# Altium schematic sheet BMS_V5.SchDoc
size A3; SheetNumber: 1; SheetTotal: 1
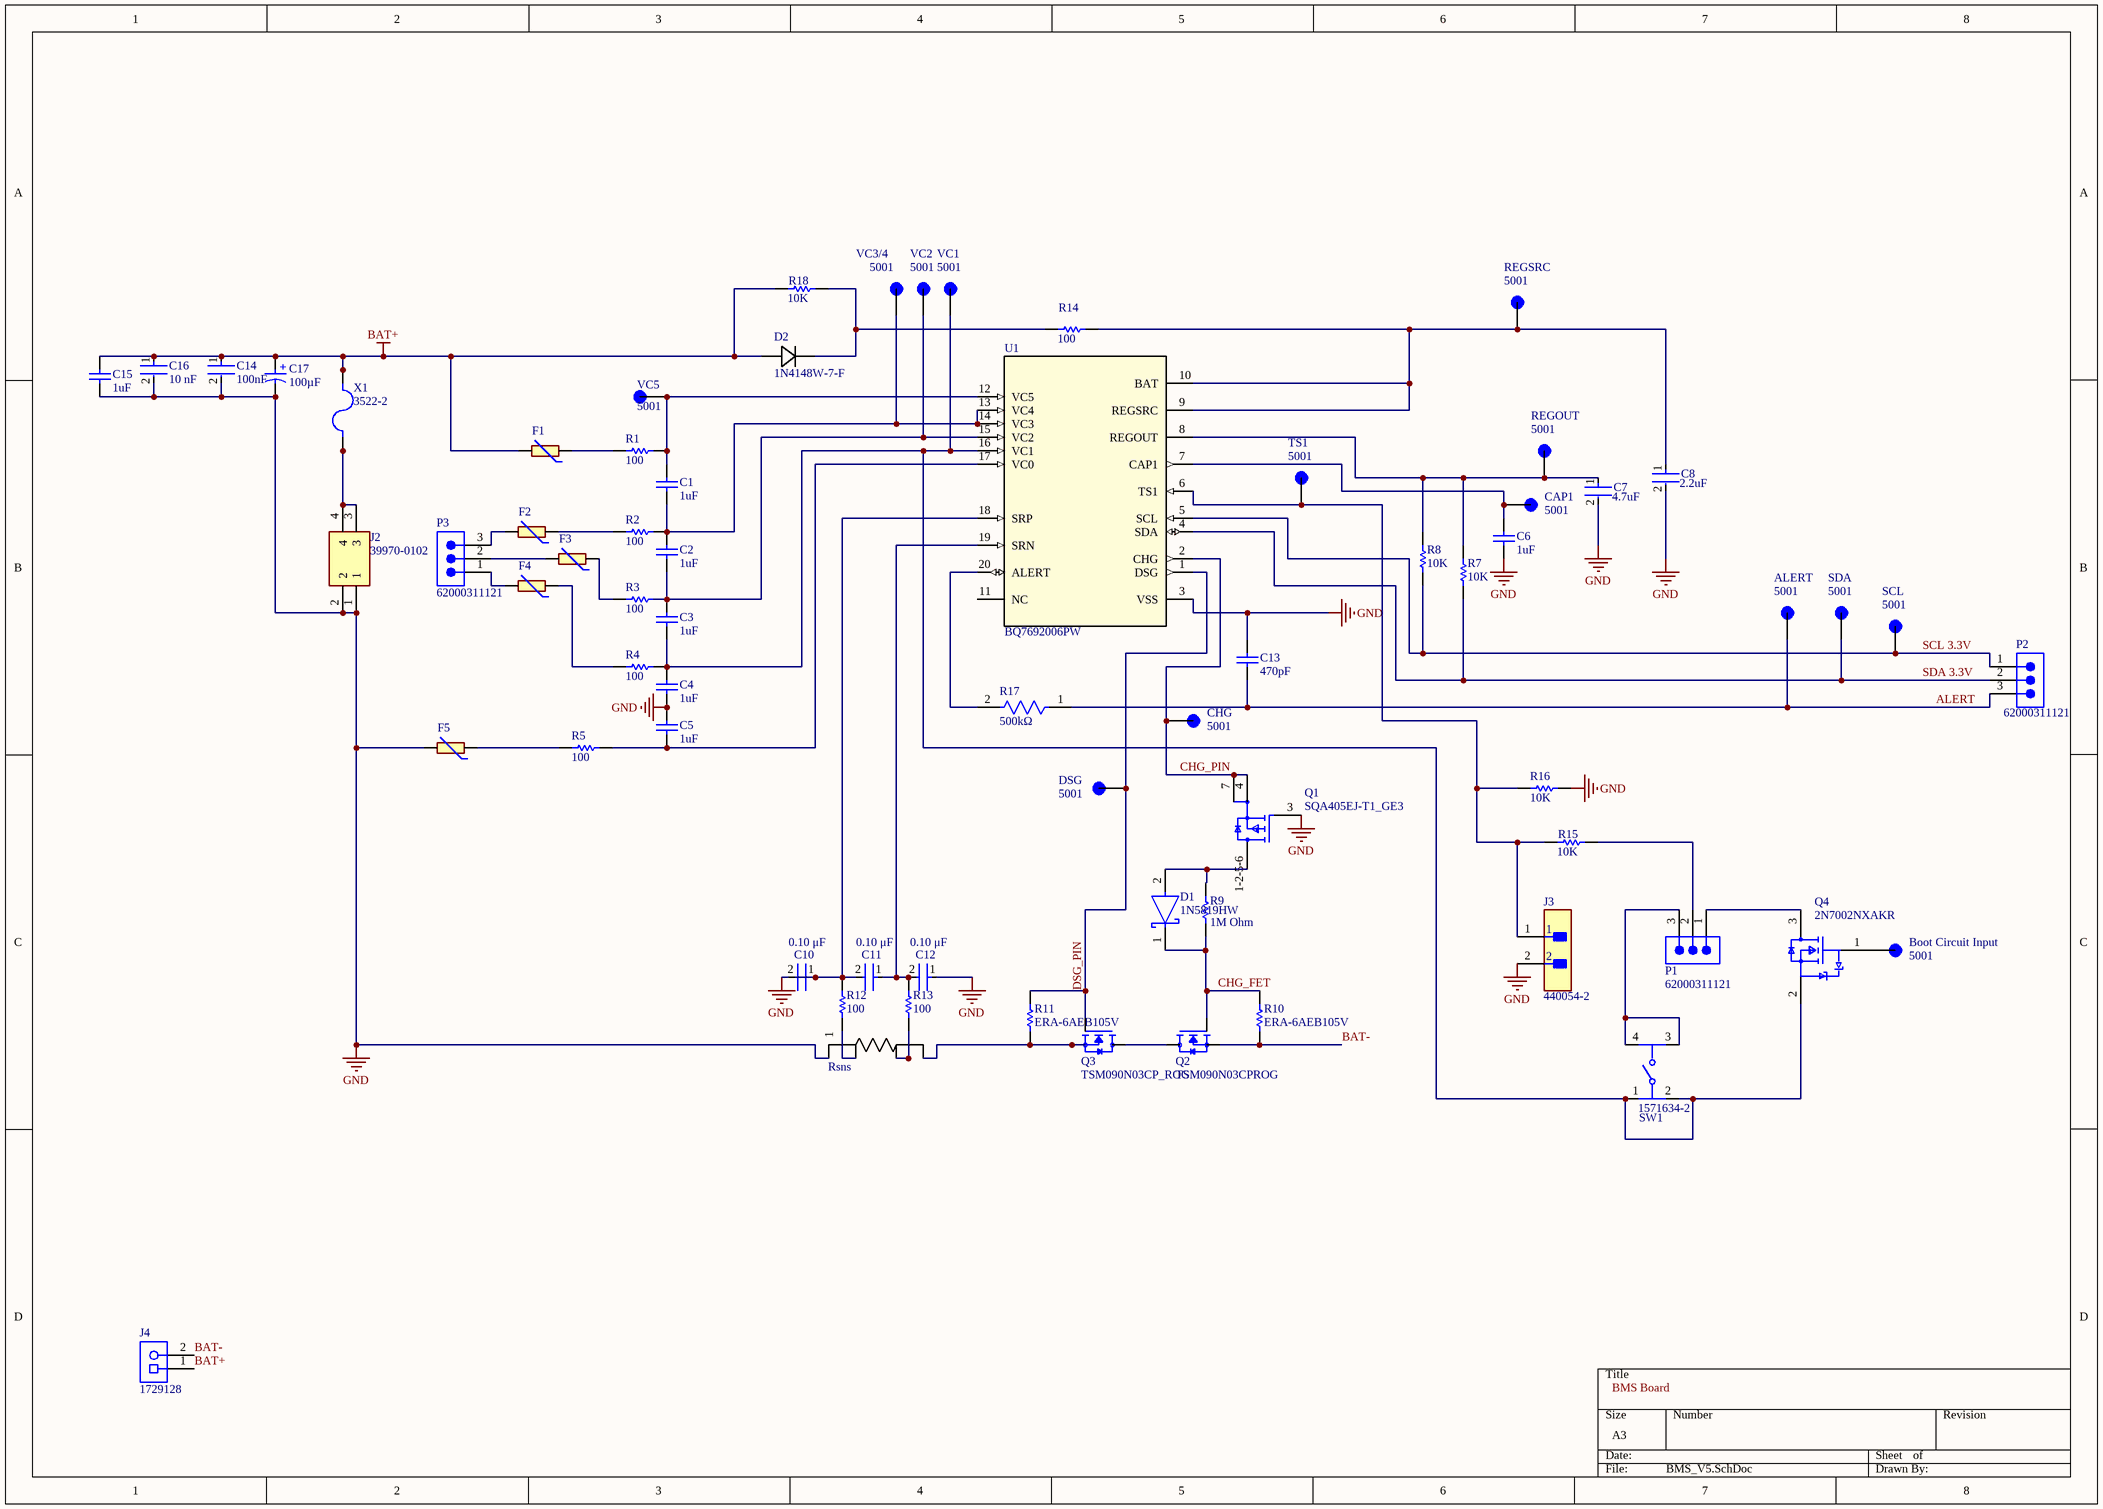
[diagram p0: BMS_V5.SchDoc]

## Parts
ALERT  5001  [KEYSTONE_5001]
Boot_Circuit_Input  5001  [KEYSTONE_5001]
C1  1uF  [CAPC2013X140X50LL20T25]
C2  1uF  [CAPC2013X140X50LL20T25]
C3  1uF  [CAPC2013X140X50LL20T25]
C4  1uF  [CAPC2013X140X50LL20T25]
C5  1uF  [CAPC2013X140X50LL20T25]
C6  1uF  [CAPC2013X140X50LL20T25]
C7  Capacitance: 4.7uF  [FP-GRM21B-0_15-IPC_B]  (hidden comment: GRM21BR61H475KE51L)
C8  Capacitance: 2.2uF  [FP-1206-L_3_2_0_15-W_1_6-IPC_C]  (hidden comment: TMK316B7225KLHT)
C10  Capacitance: 0.10 μF  [FP-C1206C-EB-MFG]  (hidden comment: C1206C104M4JACAUTO)
C11  Capacitance: 0.10 μF  [FP-C1206C-EB-MFG]  (hidden comment: C1206C104M4JACAUTO)
C12  Capacitance: 0.10 μF  [FP-C1206C-EB-MFG]  (hidden comment: C1206C104M4JACAUTO)
C13  470pF  [CAPC2013X145X48NL20T23]
C14  Capacitance: 100nF  [FP-1206-L_3_2_0_2-W_1_6_0-MFG]  (hidden comment: 12061C104KAZ2A)
C15  1uF  [CAPC2013X140X50LL20T25]
C16  value 10 nF  [FP-CC0603-DA-MFG]  (hidden comment: CC0603KRX7R9BB103)
C17  Capacitance: 100µF  [WCAP-ASLI_D6.3H7.7]  (hidden comment: 865080545012)
CAP1  5001  [KEYSTONE_5001]
CHG  5001  [KEYSTONE_5001]
D1  1N5819HW  [FP-SOD123-IPC_A]
D2  1N4148W-7-F  [SOD123_DIO]
DSG  5001  [KEYSTONE_5001]
F1  0ZCJ0005FF2E  [FUSC3216X85N]  (value not drawn)
F2  0ZCJ0005FF2E  [FUSC3216X85N]  (value not drawn)
F3  0ZCJ0005FF2E  [FUSC3216X85N]  (value not drawn)
F4  0ZCJ0005FF2E  [FUSC3216X85N]  (value not drawn)
F5  0ZCJ0005FF2E  [FUSC3216X85N]  (value not drawn)
J2  39970-0102  [399700102]
J3  440054-2  [FP-440054-2-MFG]
J4  1729128  [PHOE-1729128-2_V]
P1  62000311121  [62000311121]
P2  62000311121  [62000311121]
P3  62000311121  [62000311121]
Q1  SQA405EJ-T1_GE3  [FP-SQA405EJ-T1_GE3-MFG]
Q2  TSM090N03CPROG  [TRANS_TSM090N03CPROG]
Q3  TSM090N03CP_ROG  [TRANS_TSM090N03CP_ROG]
Q4  2N7002NXAKR  [FP-SOT23-IPC_B]
R1  100  [RESC2013X60X30ML20T20]
R2  100  [RESC2013X60X30ML20T20]
R3  100  [RESC2013X60X30ML20T20]
R4  100  [RESC2013X60X30ML20T20]
R5  100  [RESC2013X60X30ML20T20]
R7  10K  [RESC2013X60X35NL10T20]
R8  10K  [RESC2013X60X35NL10T20]
R9  1M Ohm  [RESC2013X60X40LL20T25]
R10  ERA-6AEB105V  [RESC2013X60X40LL20T25]
R11  ERA-6AEB105V  [RESC2013X60X40LL20T25]
R12  100  [RESC2013X50X30LL20T20]
R13  100  [RESC2013X50X30LL20T20]
R14  100  [RESC2013X60X30ML20T20]
R15  10K  [RESC2013X60X35NL10T20]
R16  10K  [RESC2013X60X35NL10T20]
R17  Resistance: 500kΩ  [FP-CRMA1206-IPC_A]
R18  10K  [RESC2013X60X35NL10T20]
REGOUT  5001  [KEYSTONE_5001]
REGSRC  5001  [KEYSTONE_5001]
Rsns  WSL36375L000FEA  [WSL3637_VIS]  (value not drawn)
SCL  5001  [KEYSTONE_5001]
SDA  5001  [KEYSTONE_5001]
SW1  1571634-2  [FP-1571634-2-MFG]
TS1  5001  [KEYSTONE_5001]
U1  BQ7692006PW  [PW0020A_N]
VC1  5001  [KEYSTONE_5001]
VC2  5001  [KEYSTONE_5001]
VC3/4  5001  [KEYSTONE_5001]
VC5  5001  [KEYSTONE_5001]
X1  3522-2  [FUSE_3522-2]

## Nets
BAT+: C14.1 C15.2 C16.1 C17.1(P) D2.2 F1.2 J4.1 R18.1 X1.2A X1.2B
GND: C4.1 C5.2 C6.1 C7.2 C8.2 C10.2 C12.1 C13.2 C14.2 C15.1 C16.2 C17.2(N) F5.2 J2.1 J2.2 J3.2 Q1.3(G) R16.2 Rsns.1 U1.3(VSS)
ALERT: ALERT.TP C13.1 P2.3 R17.1
BAT-: J4.2 Q2.3(S) R10.1
CHG_FET: D1.1(C) Q2.1(G) R9.1 R10.2
CHG_PIN: CHG.TP Q1.4(S) Q1.7(S) U1.2(CHG)
DSG_PIN: DSG.TP Q3.1(G) R11.2 U1.1(DSG)
SCL 3.3V: P2.1 R8.1 SCL.TP U1.5(SCL)
SDA 3.3V: P2.2 R7.1 SDA.TP U1.4(SDA)
NetBoot_Circuit_Input_TP: Boot_Circuit_Input.TP Q4.1(G)
NetC1_1: C1.1 C2.2 R2.2 U1.13(VC4) U1.14(VC3) VC3/4.TP
NetC1_2: C1.2 R1.2 U1.12(VC5) VC5.TP
NetC2_1: C2.1 C3.2 R3.2 U1.15(VC2) VC2.TP
NetC3_1: C3.1 C4.2 Q4.2(S) R4.2 SW1.1 SW1.2 U1.16(VC1) VC1.TP
NetC5_1: C5.1 R5.2 U1.17(VC0)
NetC6_2: C6.2 CAP1.TP U1.7(CAP1)
NetC7_1: C7.1 R7.2 R8.2 REGOUT.TP U1.8(REGOUT)
NetC8_1: C8.1 R14.1 REGSRC.TP U1.9(REGSRC) U1.10(BAT)
NetC10_1: C10.1 C11.2 R12.2 U1.18(SRP)
NetC11_1: C11.1 C12.2 R13.2 U1.19(SRN)
NetD1_2: D1.2(A) Q1.1-2-5-6(D) R9.2
NetD2_1: D2.1 R14.2 R18.2
NetF1_1: F1.1 R1.1
NetF2_1: F2.1 R2.1
NetF2_2: F2.2 P3.3
NetF3_1: F3.1 R3.1
NetF3_2: F3.2 P3.2
NetF4_1: F4.1 R4.1
NetF4_2: F4.2 P3.1
NetF5_1: F5.1 R5.1
NetJ2_3: J2.3 J2.4 X1.1A X1.1B
NetJ3_1: J3.1 R15.1 R16.1 TS1.TP U1.6(TS1)
NetP1_1: P1.1 Q4.3(D)
NetP1_2: P1.2 R15.2
NetP1_3: P1.3 SW1.3 SW1.4
NetQ2_2: Q2.2(D) Q3.2(D)
NetQ3_3: Q3.3(S) R11.1 Rsns.4
NetR12_1: R12.1 Rsns.2
NetR13_1: R13.1 Rsns.3
NetR17_2: R17.2 U1.20(ALERT)

Not connected (* = marked no-connect by the designer): U1 11(NC)

## Notes on the sheet
- BMS Board
- (in symbol CMP-03913-54202496-1) +

## Library data of the parts
ALERT Boot_Circuit_Input CAP1 CHG DSG REGOUT REGSRC SCL SDA TS1 VC1 VC2 VC3/4 VC5 = 5001: MF: Keystone Electronics; Package: None; Price: None; Value: *; MP: 5001; Availability: Unavailable
C1-C6 C15 = CMP-2007-03234-1: Part Number: C0805C105K3RACTU; Manufacturer: Kemet
C7 = CMP-06035-059131-1: Chip Multilayer Ceramic Capacitors for General Purpose, 0805, 4.7uF, X5R, 15%, 10%, 50V; Case Code (Metric): 2012; Height: 1.25mm; Width: 0.049inch; Packaging: Tape and Reel; Mount: Surface Mount; Case/Package: 0805; REACH SVHC: No SVHC; Case Code (Imperial): 0805; Dielectric: X5R; Thickness: 0.055inch; Voltage Rating: 50V; Material: Ceramic; Depth: 1.25mm; Min Operating Temperature: -55°C; Lead Free: Lead Free; Max Operating Temperature: 85°C; Tolerance: 10%; Length: 2mm; Voltage Rating (DC): 50V
C8 = CMP-14477-002871-2: None; Voltage Rating: 25V; Tolerance: 10%; Dielectric: X7R; Min Operating Temperature: -55°C; Max Operating Temperature: 125°C; Height: 1.6mm; RoHS Compliant: Yes; Voltage Rating (DC): 25V; Case Code (Metric): 3216; Package Quantity: 2000; Packaging: Tape and Reel; Width: 0.063inch; Termination: SMD/SMT; Case/Package: 1206; Mount: Surface Mount; Ratings: AEC-Q200; Halogen Free: Halogen Free; Case Code (Imperial): 1206; Lead Free: Lead Free; Length: 0.126inch; Thickness: 0.071inch
C10-C12 = CMP-03020-020536-1: C1206 0.10 μF U2J 20.00% 16 V; Manufacturer: KEMET; Tolerance: 0.2; Temperature Coefficient: 15%; Value: 0.10 μF; Automotive Grade: Grade 0; Voltage Rating: 16 V; Material: Ceramic; ComponentLink2URL: https://content.kemet.com/datasheets/KEM_C1007_X8R_ULTRA_150C_SMD.pdf; ComponentLink2Description: Datasheet; Temperature Range Low: -55°C; Temperature Characteristic: U2J; Category: Cap; Height: 0.88mm; Manufacturer Part Number: C1206C104M4JACAUTO; Octopart: https://octopart.com/c1206c104m4jacauto-kemet-84732525; Device Class L1: Passive Components; Automotive: Yes; RoHS: TRUE; Temperature: -55°C to +150°C; Device Class L2: Capacitors; Ipc Land Pattern Name: CAPC320160X78; Device Class L3: Ceramic Capacitors; Package: C1206C-EB; Temperature Range High: +150°C; Lead Free: Yes
C13 = CMP-2007-01712-1: Manufacturer: Vitramon; Part Number: VJ0805Y471KXAAC
C14 = CMP-04427-004798-1: General Purpose Ceramic Capacitor, 1206, 100nF, 10%, X7R, 15%, 100V; Features: Soft Termination; Termination: SMD/SMT; Mount: Surface Mount; Tolerance: 10%; Voltage Rating: 100V; Length: 3.2mm; Case/Package: 1206; Case Code (Metric): 3216; RoHS Compliant: Yes; Package Quantity: 1; Max Operating Temperature: 125°C; Voltage Rating (DC): 100V; Min Operating Temperature: -55°C; Number of Pins: 2; Packaging: Tape and Reel; Width: 0.063inch; REACH SVHC: No SVHC; Lead Free: Lead Free; Construction: Flat; Radiation Hardening: No; Case Code (Imperial): 1206; Thickness: 0.05inch; Series: FLEXITERM®; Depth: 1.6mm; Dielectric: X7R
C16 = CMP-2100-03600-2: CAP CER 10000PF 50V X7R 0603; Manufacturer: YAGEO; Tolerance: 0.1; Material: Ceramic; Temperature Coefficient: 15%; Mouser Description: Multilayer Ceramic Capacitor, CC Series, 0.01 - F, - 10%, X7R, 50 V, 0603 [1608 Metric]; Digikey Description: CAP CER 10000PF 50V X7R 0603; Height: 0.9mm; Category: Cap; Temperature Characteristic: X7R; Footprint Url: http://www.yageo.com/exep/pages/download/literatures/UPY-C_GEN_24.pdf; Lead Free: Yes; Voltage Rating: 50 V; Manufacturer Part Number: CC0603KRX7R9BB103; Temperature: -55°C to +125°C; Device Class L3: Ceramic Capacitors; ComponentLink2Description: Datasheet; Voltage: 50 V; Package: CC0603-DA; Octopart: https://octopart.com/cc0603krx7r9bb103-yageo-192938; Automotive: No; Temperature Range High: +125°C; Temperature Range Low: -55°C; RoHS: TRUE; Device Class L1: Passive Components; ComponentLink2URL: http://www.yageo.com/documents/recent/UPY-GPHC_X7R_6.3V-to-50V_18.pdf; Device Class L2: Capacitors; Capacitance: 10 nF
C17 = CMP-03913-54202496-1: 865080545012 Cap Aluminum Lytic 100uF 35V 20% (6.3 X 7.7mm) SMD 300mA 2000h 105C T/R; Leakage Current: 35µA; Impedance: 380mΩ; Life (Hours): 2000hours; Dissipation Factor: 14%; Insulation Resistance: 1MΩ; ESR (Equivalent Series Resistance): 321.392mΩ; Case/Package: Radial; Packaging: Cut Tape; REACH SVHC: Unknown; Voltage Rating (DC): 35V; Diameter: 6.3mm; Min Operating Temperature: -55°C; Ripple Current: 300mA; Height: 7.7mm; Voltage Rating: 35V; RoHS: Compliant; Width: 6.6mm; Ripple Current (AC): 300mA; NexarPartId: 54202496; Max Operating Temperature: 105°C; Tolerance: 20%; Length: 7.7mm
D1 = CMP-0303-00003-3: DIODE SCHOTTKY 40V 1A SOD123; Forward Voltage: 450mV; Capacitance: 110pF; Max Forward Surge Current (Ifsm): 25A; Peak Reverse Current: 50uA; Polarity: Standard; Element Configuration: Single; Max Power Dissipation: 450mW; Min Operating Temperature: -65°C; Package Quantity: 3000; Contact Plating: Tin; Weight: 0.000353oz; Max Repetitive Reverse Voltage (Vrrm): 40V; Max Reverse Voltage (DC): 40V; Height: 1.25mm; Average Rectified Current: 1A; Width: 1.7mm; Case/Package: SOD-123-2; Lead Free: Lead Free; Max Operating Temperature: 125°C; Current Rating: 1A; Termination: SMD/SMT; Forward Current: 1A; Radiation Hardening: No; Number of Pins: 2; Length: 2.85mm; Voltage Rating (DC): 40V; REACH SVHC: No SVHC; Peak Non-Repetitive Surge Current: 25A; Packaging: Tape and Reel; Output Current: 1A
D2 = 1N4148W-7-F: DIODE; SWT; SMT (SOD-123); PIV=100V; IF=0.3A; -65 DEGC TO +150 DEGC; Manufacturer_Name: Diodes Inc; Copyright: Copyright (C) 2025 Ultra Librarian. All rights reserved.; Manufacturer_Part_Number: 1N4148W-7-F
F1-F5 = 0ZCJ0005FF2E: MF: {'manufacturer': u'Bel Fuse Inc.'}; Package: None; Price: None; Value: *; MP: 0ZCJ0005FF2E; Availability: Unavailable
J2 = 39970-0102: 10.16mm Beau Eurostyle Fixed Mount PCB Terminal Block, High Power 40A,  Circuits; Manufacturer_Name: Molex; Geometry.Height: 30mm; Manufacturer_Part_Number: 39970-0102; Mouser Part Number: 538-39970-0102; Mouser Price/Stock: https://www.mouser.co.uk/ProductDetail/Molex/39970-0102?qs=E1QQzziZK0%252BNAsw%2FMf08Pw%3D%3D; Arrow Part Number: *; Arrow Price/Stock: *; Datasheet Link: https://www.molex.com/pdm_docs/sd/399700102_sd.pdf
J3 = CMP-03369-000005-1: CONN HEADER VERT 2POS 2MM; Manufacturer: TE Connectivity; Conn Gender: Male; Conn Orientation: Vertical; Voltage Rating: 250V; Number Of Contacts: 2; Current Rating: 3A; ComponentLink2Description: Datasheet; Temperature Range Low: -25°C; Contact Material: Tin,Nickel; Device Class L3: unset; Digikey Description: CONN HEADER VERT 2POS 2MM; Temperature: -25°C to +85°C; Mouser Description: Headers & Wire Housings 2.0mm HDR 2pos VERT HPI; Manufacturer Part Number: 440054-2; Package: 440054-2; Lead Free: Yes; ComponentLink2URL: https://www.te.com/usa-en/product-440054-2.datasheet.pdf; Number Of Rows: 1; Octopart: https://octopart.com/440054-2-te+connectivity-40237927; Category: Conn; Temperature Range High: +85°C; Footprint Url: https://www.te.com/commerce/DocumentDelivery/DDEController?Action=showdoc&DocId=Customer+Drawing%7F440054%7FF6%7Fpdf%7FEnglish%7FENG_CD_440054_F6.pdf%7F440054-2; Pitch: 2mm; Device Class L1: Connectors; RoHS: TRUE; Height: 6.35mm; Device Class L2: Headers and Wire Housings; Automotive: No
J4 = CMP-2000-05815-1: PCB Terminal Block, 13.5 A, 400 V, 2-Pin THD, RoHS, Bulk; Manufacturer: Phoenix Contact; Package Version: 03/2015; No. of Rows: 1; Pitch: 5.08mm; No. of Positions: 2; Voltage Rating: 400V; Current Rating: 13500mA; Manufacturer URL: http://www.phoenixcontact.com/; Datasheet URL: https://datasheet.ciiva.com/16046/1729128-16046181.pdf; RoHS: TRUE; Package URL: https://www.phoenixcontact.com/online/portal/pi/pxc/product_detail_page/!ut/p/b1/3VdJjqNKFDxLH8AFycySyWY2ozFsEPOMMQaDOX1XedGL_1Vdm5YXJleknhSKeBkvI6EA8ncAo3AYoDhBQGco6KN7VURTdemj9us_IEKEZo_YHiPAEWEFmDGOHMORkqKYCORBZxgL7ZoaZYcbFFUZ3fqxSY6GOuxydWUuHqz1ynmMFygu583Bob0Ewr6Sd_l-5m-kAueHiB0jpRwZwe58wwtkpxtMYd_LmGcDRU02dRNEyWt6Y2ti5pSyJ_reIkzIulrqApdnbT11V5jnCKbYNCvhEM1MCpPByat_X379-iThf08CI5GfOPqfBeS3BRoBOdD55AKVv0iLwCMq-2BrzXWSGRH7pUGD9uwXQjiph3xL0DKQwdGa0JImiIOmBNOestqgwTHSSs2oOep-78apyXQBvNi8ZLaFjvjWvcaUEBu0MC6Wbe-d6mB0FAebo2lUWinqYaZs5DAYzV0RP9yitUjnGJ0iI9xhZkT42OCQNUJJhkgWINNQLP2JFP6OpMg3JCVg70jqHT0lvKOnhHf0lPuOnnLf0VPuWx6_dxwUIvwk5WMkT0kLL1mh61l2yZVSzG3pYV_bqo-mj6uMKwKwdnnW8Jh5RTOJzMOA5c-eJDaZQw4mTMPH02PvS_ZAqNVjVTo2WyYLkwH_KU1mmmG5kjRhDqPXLwwVHvVOjCM60-fpXvTDfMGW1PVFVS1r4e4yVDk4ZdNbkUHvqPqQSeian4UD39fNKmachqdJ1NJbyk8rXT9mXTvPk3oE5meulKGgiruPJek-4I9hTT6G8ZLOyRSm2RRVbThERQad5OS28hdt4YW4vG0stgYYzsWsK4_7y6DZMjJSCqri1kyiZR5vD7pwIrNR7QwPHTcLTI5qT7eRlpHrdGiupYlqQDJ7zy_CND8fWWBoLRXxk1RVcXiBQwbTD4Xi7KL-FuO94t9xaqweXzH; PartNumber: 1729128; Package Description: 2-Pin Through Hole Device, Body 8.1 x 10.16 mm, Pitch 5.08 mm; Datasheet Version: 12/2013; Mounting Technology: ThroughHole; Orientation: Horizontal; Package Reference: 1729128-2; Packing: Bulk
P1-P3 = CMP-1502-00957-4: NexarPartId: 61924779; Contact Resistance: 20mΩ; Voltage Rating: 200V; Current Rating: 2A; Number of Contacts: 3; Gender: Male; Max Operating Temperature: 105°C; Min Operating Temperature: -40°C; Number of Pins: 3; RoHS: Non-Compliant; Contact Material: Gold; Height: 6.35mm; Operating Supply Voltage: 200V; Number of Rows: 1; Lead Pitch: 2mm; Orientation: Vertical
Q1 = CMP-02550-000254-1: MOSFET P-CH 40V 10A PPAK SC70-6
Q2 = CMP-013-00034-1: N-Channel 30 V 50A (Tc) 40W (Tc) Surface Mount TO-252 (DPAK); MF: Taiwan Semiconductor; Case/Package: TO-252-3 Taiwan Semiconductor; Design Item ID: TSM090N03CPROG; Value: *; Pins: 3; Check_prices: https://www.snapeda.com/parts/TSM090N03CPROG/taiwan/view-part/?ref=eda; MP: TSM090N03CPROG; SnapEDA_Link: https://www.snapeda.com/parts/TSM090N03CPROG/taiwan/view-part/?ref=snap; Source: TSM090N03CPROG.SchLib; Component Type: Standard
Q4 = CMP-14409-000026-2: 2N7002NXAK/SOT23/TO-236AB
R1-R5 R14 = CMP-2001-01991-1: Part Number: RK73H2ATTD1000F; Manufacturer: KOA Speer
R7 R8 R15 R16 R18 = CMP-1659-00013-4: Chip Resistor, 10 KOhm, +/- 1%, 0.125 W, -55 to 155 degC, 0805 (2012 Metric), RoHS, Tape and Reel; Manufacturer: Yageo; Voltage Rating: 150 V; Mount: Surface Mount; ComponentLink1Description: Manufacturer URL; ComponentLink2URL: http://www.yageo.com/documents/recent/PYu-RC_Group_51_RoHS_L_04.pdf; Pins: 2; Length: 2 mm; Min Operating Temperature: -55 degC; Height: 0.5 mm; Mounting Technology: Surface Mount; RoHSCompliant: true; REACH SVHC: No SVHC; ComponentLink1URL: http://www.yageo.com/; Max Operating Temperature: 155 degC; PackageReference: 0805; DatasheetVersion: Rev. 4, 02/2016; Package Quantity: 5000; Packaging: Tape and Reel; ComponentLink2Description: Datasheet; PackageDescription: 2-Pin Surface Mounted Device, Body 2 x 1.25 mm
R9 = CMP-2001-00584-1: Part Number: ERA-6AEB105V; Manufacturer: Panasonic
R10 R11 = CMP-2001-00584-1: Manufacturer: Panasonic; Part Number: ERA-6AEB105V
R12 R13 = CMP-2001-04901-1: Manufacturer: Vishay Dale; Part Number: CRCW0805100RFKEA
R17 = CMP-00030-87449095-1: CRMA1206AF500KFKEF Res Thick Film 1206 500K Ohm 1% 0.3W ±100ppm/C Pad SMD Automotive T/R; Power Rating: 300mW; Temperature Coefficient: 100ppm/°C; Voltage Rating: 1kV; Height: 740µm; Schedule B: 8533210045, 8533210045; Case/Package: 1206; Max Operating Temperature: 155°C; Min Operating Temperature: -55°C; Tolerance: 1%; Composition: Thick Film; NexarPartId: 87449095; RoHS: Non-Compliant
Rsns = CMP-009-00178-1: WSL-3637 .005 1% EA e3; Manufacturer_Name: Vishay; Manufacturer_Part_Number: WSL36375L000FEA; Design Item ID: WSL36375L000FEA; Source: WSL36375L000FEA.SchLib; Copyright: Copyright (C) 2025 Ultra Librarian. All rights reserved.
SW1 = CMP-03407-000008-1: SWITCH TACTILE SPST-NO 0.05A 24V; Actuator Length: 0.094inch; Max Current Rating: 50mA; Voltage Rating (DC): 12V; Actuator Material: Rubber; Switch Function: Off-Mom; Mechanical Life: 5000000Cycles; Actuator Type: Standard; Actuator Color: Natural; Illumination Type: Illuminated; Operating Force: 160gf; Throw Configuration: SPST; Package Quantity: 1000; Max Operating Temperature: 85°C; Mount: Surface Mount; Contact Plating: Silver; Depth: 10mm; Min Operating Temperature: -40°C; Radiation Hardening: No; ELV: Compliant; Case/Package: SMD/SMT; Length: 6.2mm; Termination: Gull Wing; Type: Switch; RoHS Compliant: Yes; Current Rating: 50mA; Contact Current Rating: 50mA; Orientation: Straight; Packaging: Tape and Reel; Max Voltage Rating (DC): 12V; Lead Free: Lead Free; Contact Material: Stainless Steel
U1 = BQ7692006PW: 3 to 5-Series Cell Li-Ion and Li-Phosphate Battery Monitor (bq76940 Family) 20-TSSOP -40 to 85; Manufacturer_Name: Texas Instruments; TYPE: TYPE; RefDes: RefDes; Copyright: Copyright (C) 2025 Ultra Librarian. All rights reserved.; Manufacturer_Part_Number: BQ7692006PW; Datasheet: https://www.ti.com/lit/gpn/bq76920
X1 = 3522-2: MF: {'manufacturer': u'Keystone Electronics'}; Availability: Unavailable; Price: None; Value: *; MP: 3522-2; Package: None
Q3 = TSM090N03CP_ROG: Package: None; Price: None; Value: *; MP: TSM090N03CP_ROG; Availability: Unavailable